# Altium schematic sheet Sheet_LoraE32_Transmission_V1.1.SchDoc
size A4
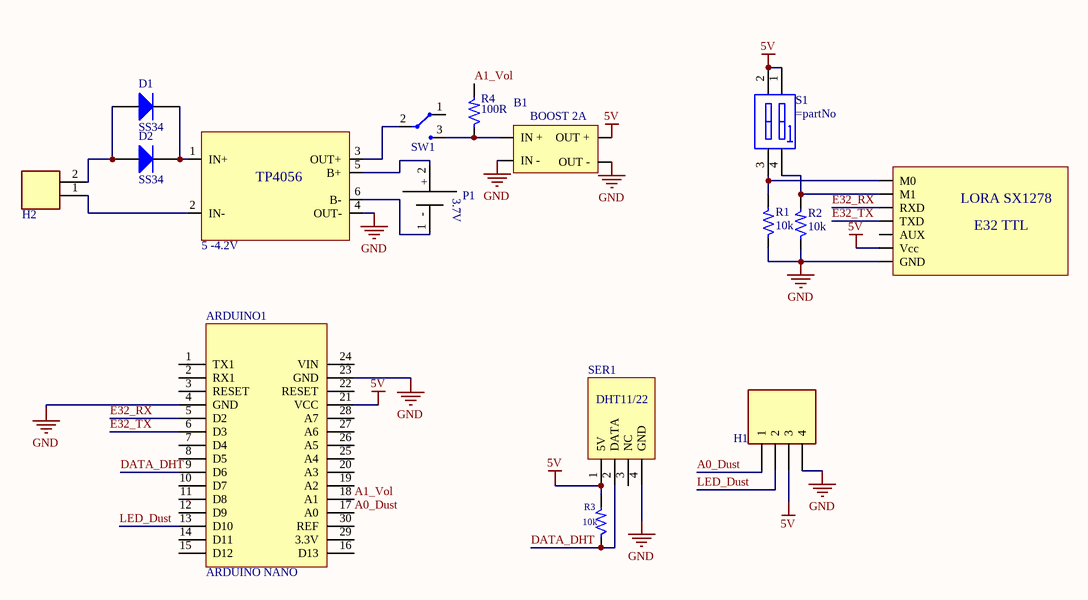
[diagram p0: Sheet_LoraE32_Transmission_V1.1.SchDoc]

## Parts
?  LORA E32 TTL  [LORA E32 TTL]  (value not drawn)
ARDUINO1  ARDUINO NANO  [ARDUINO PRO NANO]
B1  Boost 2A  [PCB_Boost 2A]  (value not drawn)
D1  SS34  [DIODE SMA]
D2  SS34  [DIODE SMA]
H1  Dust_Sharp  [Header 4P 2.54]  (value not drawn)
H2  Solar  [Header 2P 2.54]  (value not drawn)
P1  (no value)  [Pin 18650 x1 loai 1]
R1  10k  [R1/4W]
R2  10k  [R1/4W]
R3  10k  [RES-1206]
R4  100R  [R1/4W]
S1  (no value)  [SW-DIP2]
SER1  DHT11/22  [DHT11_H]
SW1  CongTacGat  [CongTacGat1]  (value not drawn)
TP4056  5 -4.2V  [TP4056]

## Nets
5V: ?.2(Vcc) ARDUINO1.21(VCC) B1.1(OUT_+) H1.3 R3.2 S1.1 S1.2 SER1.1(5V)
GND: ?.1(GND) ARDUINO1.4(GND) ARDUINO1.23(GND) B1.2(OUT_-) B1.4(IN_-) H1.4 R1.1 R2.1 SER1.4(GND) TP4056.4(OUT-)
A0_Dust: ARDUINO1.17(A0) H1.1
A1_Vol: ARDUINO1.18(A1) R4.2
DATA_DHT: ARDUINO1.9(D6) R3.1 SER1.2(DATA)
E32_RX: ?.5(RXD) ARDUINO1.5(D2)
E32_TX: ?.4(TXD) ARDUINO1.6(D3)
LED_Dust: ARDUINO1.13(D10) H1.2
Net?_6: ?.6(M1) R2.2 S1.4
Net?_7: ?.7(M0) R1.2 S1.3
NetB1_3: B1.3(IN_+) R4.1 SW1.3
NetD1_1: D1.1(A) D2.1(A) H2.2
NetD1_2: D1.2(K) D2.2(K) TP4056.1(IN+)
NetH2_1: H2.1 TP4056.2(IN-)
NetP1_1: P1.1(-) TP4056.6(B-)
NetP1_2: P1.2(+) TP4056.5(B+)
NetSW1_2: SW1.2 TP4056.3(OUT+)

Not connected (* = marked no-connect by the designer): ? 3(AUX); ARDUINO1 1(TX1) 2(RX1) 3(RESET) 7(D4) 8(D5) 10(D7) 11(D8) 12(D9) 14(D11) 15(D12) 16(D13) 19(A2) 20(A3) 22(RESET) 24(VIN) 25(A4) 26(A5) 27(A6) 28(A7) 29(3.3V) 30(REF); SER1 3(NC); SW1 1

## Notes on the sheet
- (in symbol Boost 2A) BOOST 2A
- (in symbol LORA E32 TTL) LORA SX1278; E32 TTL
- (in symbol Pin18650) +         -; 3.7V

## Library data of the parts
D1 D2 = Diode SS34 ( 1N5822 ): Dán; Don_Vi: Con; Ma_Hang: MH002104; Ten_Linh_Kien: Diode SS34 3A 40V SMA ( 1N5822 SS34A); Kieu_Chan: *; Chung_Loai: Dán
H1 = Header 4P
H2 = Header 2P
P1 = Pin18650
R1 R2 R4 = Res DIP: Res
R3 = Res SMD: Res
S1 = SWDIP2: WS-DITV 2.54 mm small compact THT flat actuator with top tape; Manufacturer: Wurth Elektronik; Part No.: 418127160902; ComponentLink1 Description: Manufacturer; ComponentLink2 Description: Datasheet; Pole: 02; Created Date: Dec.2015; ComponentLink1URL: http://www.we-online.com; ComponentLink2URL: http://katalog.we-online.de/em/datasheet/4181271609xx.pdf; Created by: Baojun Chen
TP4056 = TP4056